# Altium schematic sheet CON_MC_XMC_J11_64PIN.SchDoc
size A4
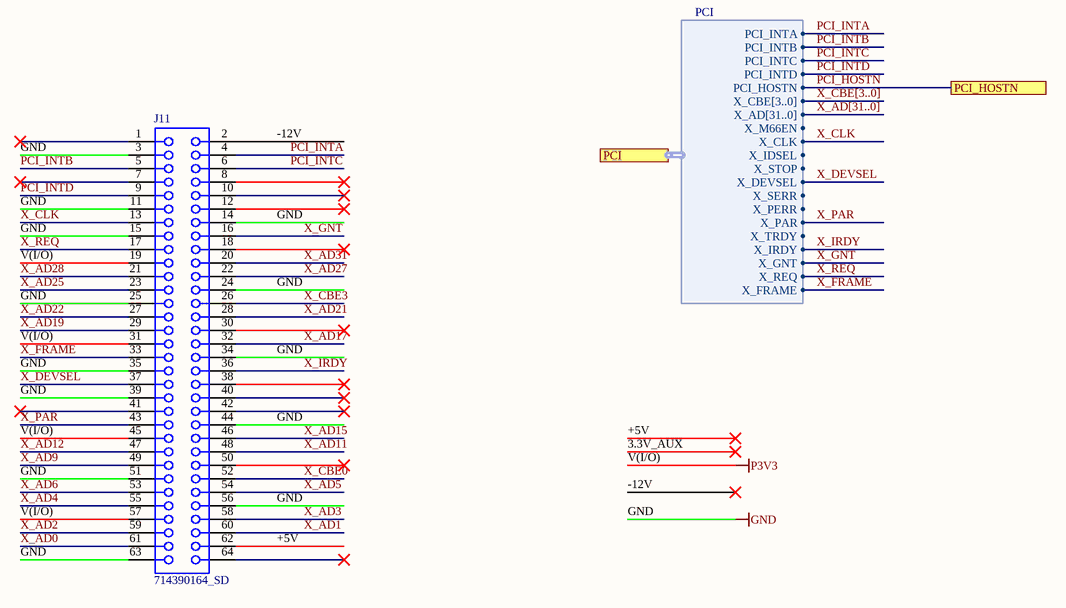
[diagram p0: CON_MC_XMC_J11_64PIN.SchDoc]

## Parts
J11  714390164_SD  [BTB1-2V64F]

## Ports
PCI (harness PCI), PCI_HOSTN

## Harnesses
PCI: PCI_INTA, PCI_INTB, PCI_INTC, PCI_INTD, PCI_HOSTN, X_CBE[3..0], X_AD[31..0], X_M66EN, X_CLK, X_IDSEL, X_STOP, X_DEVSEL, X_SERR, X_PERR, X_PAR, X_TRDY, X_IRDY, X_GNT, X_REQ, X_FRAME

## Nets
GND: J11.3 J11.11 J11.14 J11.15 J11.24 J11.25 J11.34 J11.35 J11.39 J11.44 J11.51 J11.56 J11.63
V(I/O): J11.19 J11.31 J11.45 J11.57  [also labelled P3V3]
+5V: J11.62
-12V: J11.2
PCI_HOSTN: port PCI_HOSTN, port PCI.PCI_HOSTN
PCI_INTA: J11.4 ; port PCI.PCI_INTA
PCI_INTB: J11.5 ; port PCI.PCI_INTB
PCI_INTC: J11.6 ; port PCI.PCI_INTC
PCI_INTD: J11.9 ; port PCI.PCI_INTD
X_AD0: J11.61
X_AD1: J11.60
X_AD2: J11.59
X_AD3: J11.58
X_AD4: J11.55
X_AD5: J11.54
X_AD6: J11.53
X_AD9: J11.49
X_AD11: J11.48
X_AD12: J11.47
X_AD15: J11.46
X_AD17: J11.32
X_AD19: J11.29
X_AD21: J11.28
X_AD22: J11.27
X_AD25: J11.23
X_AD27: J11.22
X_AD28: J11.21
X_AD31: J11.20
X_CBE0: J11.52
X_CBE3: J11.26
X_CLK: J11.13 ; port PCI.X_CLK
X_DEVSEL: J11.37 ; port PCI.X_DEVSEL
X_FRAME: J11.33 ; port PCI.X_FRAME
X_GNT: J11.16 ; port PCI.X_GNT
X_IRDY: J11.36 ; port PCI.X_IRDY
X_PAR: J11.43 ; port PCI.X_PAR
X_REQ: J11.17 ; port PCI.X_REQ

Not connected (* = marked no-connect by the designer): J11 1* 7* 8* 10* 12* 18* 30* 38* 40* 41* 42* 50* 64*

## Buses and harness runs
bus X_AD[31..0]
bus X_CBE[3..0]

## Library data of the parts
J11 = CMP-0001-00081-1: Board-to-Board Connector, Vertical, 2-Row, Pitch 1mm, 64-Position, Female; Mating Connector: Molex-714360164; ClassName: Board Template Connector; Datasheet Version: Apr-2006; Package Reference: BTB1-2V64F; Publisher: Altium; Component Kind: Standard